# Altium schematic sheet Sch_Dr_EEPROM .SchDoc
size A4 portrait; Author: Noname; CompanyName: Spec Company; Address3: ULY
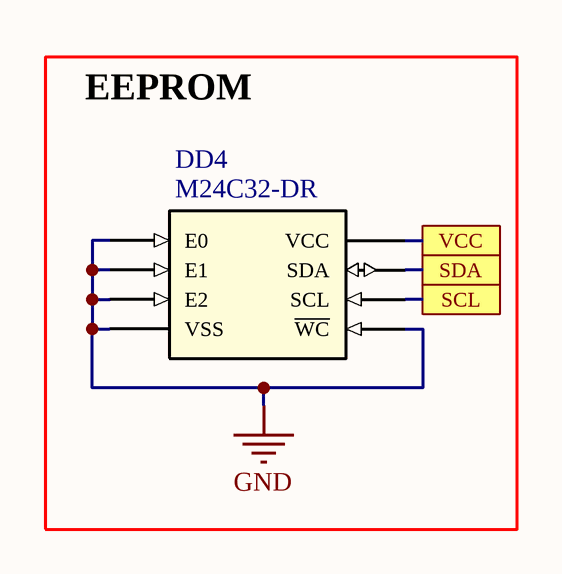
[diagram p0: Sch_Dr_EEPROM .SchDoc]

## Parts
DD4  M24C32-DR  [TSSOP-8]

## Blocks framed on the sheet
EEPROM: DD4

## Ports
SCL, SDA, VCC

## Nets
GND: DD4.1(E0) DD4.2(E1) DD4.3(E2) DD4.4(VSS) DD4.7(~{WC})
SCL: DD4.6(SCL) ; port SCL
SDA: DD4.5(SDA) ; port SDA
VCC: DD4.8(VCC) ; port VCC

## Notes on the sheet
- Title
- Size:
- Date:
- A4
- Number:
- Time:
- Revision:
- Sheet
- of
- File:

## Library data of the parts
DD4 = M24C32-DR: EEPROM Memory IC 32Kb (4K x 8) I²C 1 MHz 450 ns